# Altium schematic sheet RS_232.SchDoc
size A4; SheetNumber: 2; SheetTotal: 6
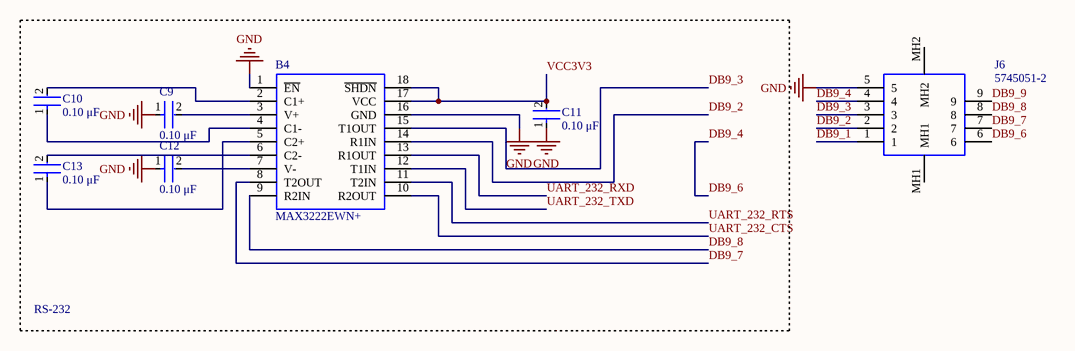
[diagram p0: RS_232.SchDoc]

## Parts
B4  MAX3222EWN+  [SOIC127P1032X265-18N]
C9  value 0.10 μF  [FP-C0805C-DN-MFG]  (hidden comment: C0805C104K5RAC7411)
C10  value 0.10 μF  [FP-C0805C-DN-MFG]  (hidden comment: C0805C104K5RAC7411)
C11  value 0.10 μF  [FP-C0805C-DN-MFG]  (hidden comment: C0805C104K5RAC7411)
C12  value 0.10 μF  [FP-C0805C-DN-MFG]  (hidden comment: C0805C104K5RAC7411)
C13  value 0.10 μF  [FP-C0805C-DN-MFG]  (hidden comment: C0805C104K5RAC7411)
J6  5745051-2  [57450512]

## Blocks framed on the sheet
RS-232: B4 C9-C13

## Nets
GND: B4.1(~{EN}) B4.16(GND) C9.1 C11.1 C12.1 J6.5
DB9_1: J6.1
DB9_2: B4.14(R1IN) J6.2
DB9_3: B4.15(T1OUT) J6.3
DB9_4: J6.4 J6.6  [also labelled DB9_6]
DB9_7: B4.8(T2OUT) J6.7
DB9_8: B4.9(R2IN) J6.8
DB9_9: J6.9
UART_232_CTS: B4.10(R2OUT)
UART_232_RTS: B4.11(T2IN)
UART_232_RXD: B4.13(R1OUT)
UART_232_TXD: B4.12(T1IN)
VCC3V3: B4.17(VCC) B4.18(~{SHDN}) C11.2
NetB4_2: B4.2(C1+) C10.2
NetB4_3: B4.3(V+) C9.2
NetB4_4: B4.4(C1-) C10.1
NetB4_5: B4.5(C2+) C13.1
NetB4_6: B4.6(C2-) C13.2
NetB4_7: B4.7(V-) C12.2

Not connected (* = marked no-connect by the designer): J6 MH1 MH2

## Library data of the parts
B4 = MAX3222EWN+: RS-232 Interface IC 3.0V to 5.5V, Low-Power, up to 1Mbps, True RS-232 Transceivers Using Four 0.1 uF External Capacitors; Manufacturer_Name: Maxim Integrated; Geometry.Height: 2.65mm; Mouser Part Number: 700-MAX3222EWN; Mouser Price/Stock: https://www.mouser.co.uk/ProductDetail/Maxim-Integrated/MAX3222EWN%2b?qs=CDqwynd4ZNrAONYHXo3EOQ%3D%3D; Manufacturer_Part_Number: MAX3222EWN+; Datasheet Link: https://pdfserv.maximintegrated.com/en/ds/MAX3222-MAX3241.pdf
C9-C13 = CMP-2007-00277-3: C0805 0.10 μF X7R 30ppm/°C 10.00% 50 V; Manufacturer: KEMET; Material: Ceramic; Tolerance: 0.1; Voltage Rating: 50 V; Temperature: -55°C to +125°C; Device Class L3: Ceramic Capacitors; Temperature Characteristic: X7R; Device Class L1: Passive Components; Category: Cap; Temperature Coefficient: 30ppm/°C; Manufacturer Part Number: C0805C104K5RAC7411; Temperature Range High: +125°C; Height: 0.88mm; RoHS: TRUE; ComponentLink2Description: Datasheet; Lead Free: Yes; Capacitance: 0.10 μF; Package: C0805C-DN; Temperature Range Low: -55°C; ComponentLink2URL: https://content.kemet.com/datasheets/KEM_C1003_C0G_SMD.pdf; Automotive: No; Ipc Land Pattern Name: CAPC200125X78; Octopart: https://octopart.com/c0805c104k5rac7411-kemet-18508045; Device Class L2: Capacitors
J6 = 5745051-2: HD-20 PLUG 9P VERT THD INS; Manufacturer_Name: TE Connectivity; Geometry.Height: 12.47mm; Mouser Part Number: 571-5745051-2; Mouser Price/Stock: https://www.mouser.co.uk/ProductDetail/TE-Connectivity/5745051-2?qs=FlGfrDooHc0LdF1RZqeXpw%3D%3D; Manufacturer_Part_Number: 5745051-2; Datasheet Link: https://www.te.com/commerce/DocumentDelivery/DDEController?Action=showdoc&DocId=Customer+Drawing%7F5745051%7FA1%7Fpdf%7FEnglish%7FENG_CD_5745051_A1.pdf%7F5745051-2